# Altium schematic sheet top.SchDoc: Top
size A; Organization: Cal Poly Racing; engineer1: Graydon Wilson
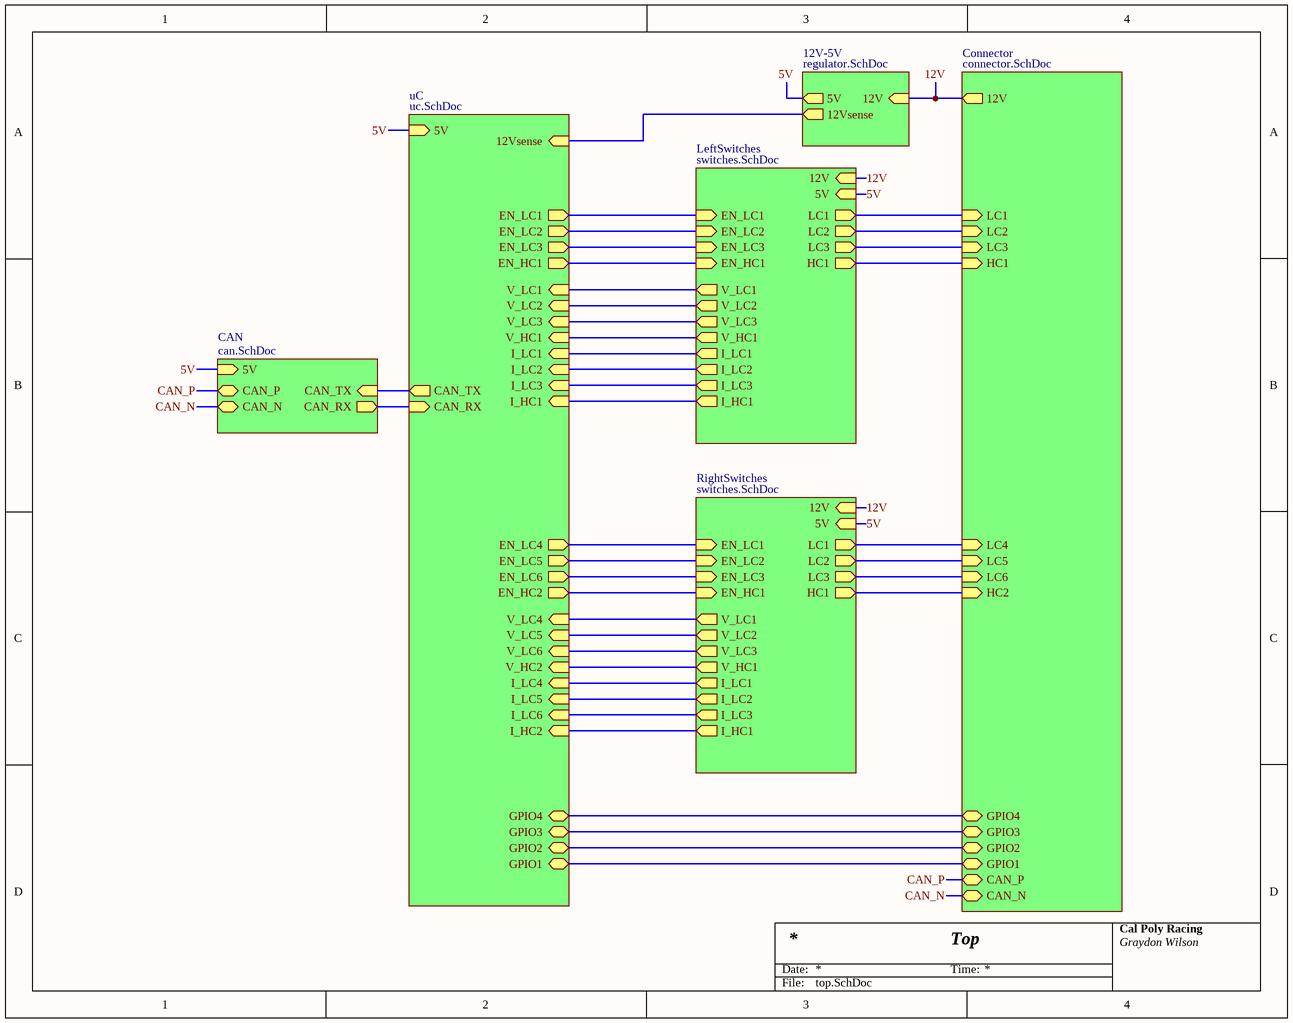
[diagram p0: top.SchDoc]

## Sub-sheets
12V-5V = regulator.SchDoc: 12V (in), 5V (out), 12Vsense (out)
CAN = can.SchDoc: 5V (in), CAN_P (bidir), CAN_N (bidir), CAN_TX (in), CAN_RX (out)
Connector = connector.SchDoc: 12V (out), LC1 (in), LC2 (in), LC3 (in), HC1 (in), CAN_P (bidir), CAN_N (bidir), LC4 (in), LC5 (in), LC6 (in), HC2 (in), GPIO4 (bidir), GPIO2 (bidir), GPIO1 (bidir), GPIO3 (bidir)
LeftSwitches = switches.SchDoc: LC1 (out), LC2 (out), LC3 (out), HC1 (out), I_LC1 (out), I_LC2 (out), I_LC3 (out), I_HC1 (out), V_HC1 (out), V_LC3 (out), V_LC2 (out), V_LC1 (out), EN_LC1 (in), EN_LC2 (in), EN_LC3 (in), EN_HC1 (in), 12V (in), 5V (in)
RightSwitches = switches.SchDoc: LC1 (out), LC2 (out), LC3 (out), HC1 (out), I_LC1 (out), I_LC2 (out), I_LC3 (out), I_HC1 (out), V_HC1 (out), V_LC3 (out), V_LC2 (out), V_LC1 (out), EN_LC1 (in), EN_LC2 (in), EN_LC3 (in), EN_HC1 (in), 12V (in), 5V (in)
uC = uc.SchDoc: CAN_TX (out), 5V (in), CAN_RX (in), EN_LC1 (out), EN_LC2 (out), EN_LC3 (out), EN_HC1 (out), V_LC1 (in), V_LC2 (in), V_LC3 (in), V_HC1 (in), I_LC1 (in), I_LC2 (in), I_LC3 (in), I_HC1 (in), EN_LC4 (out), EN_LC5 (out), EN_LC6 (out), EN_HC2 (out), V_LC4 (in), V_LC5 (in), V_LC6 (in), V_HC2 (in), I_LC4 (in), I_LC5 (in), I_LC6 (in), I_HC2 (in), GPIO1 (bidir), GPIO2 (bidir), GPIO3 (bidir), GPIO4 (bidir), 12Vsense (in)

## Nets
5V: sheet CAN/5V, sheet uC/5V, sheet LeftSwitches/5V, sheet 12V-5V/5V, sheet RightSwitches/5V
12V: sheet LeftSwitches/12V, sheet Connector/12V, sheet 12V-5V/12V, sheet RightSwitches/12V
CAN_N: sheet CAN/CAN_N, sheet Connector/CAN_N
CAN_P: sheet CAN/CAN_P, sheet Connector/CAN_P
(unnamed): sheet CAN/CAN_TX, sheet uC/CAN_TX
(unnamed): sheet CAN/CAN_RX, sheet uC/CAN_RX
(unnamed): sheet uC/EN_LC1, sheet LeftSwitches/EN_LC1
(unnamed): sheet uC/EN_LC2, sheet LeftSwitches/EN_LC2
(unnamed): sheet uC/EN_LC3, sheet LeftSwitches/EN_LC3
(unnamed): sheet uC/EN_HC1, sheet LeftSwitches/EN_HC1
(unnamed): sheet uC/V_LC1, sheet LeftSwitches/V_LC1
(unnamed): sheet uC/V_LC2, sheet LeftSwitches/V_LC2
(unnamed): sheet uC/V_LC3, sheet LeftSwitches/V_LC3
(unnamed): sheet uC/V_HC1, sheet LeftSwitches/V_HC1
(unnamed): sheet uC/I_LC1, sheet LeftSwitches/I_LC1
(unnamed): sheet uC/I_LC2, sheet LeftSwitches/I_LC2
(unnamed): sheet uC/I_LC3, sheet LeftSwitches/I_LC3
(unnamed): sheet uC/I_HC1, sheet LeftSwitches/I_HC1
(unnamed): sheet uC/EN_LC4, sheet RightSwitches/EN_LC1
(unnamed): sheet uC/EN_LC5, sheet RightSwitches/EN_LC2
(unnamed): sheet uC/EN_LC6, sheet RightSwitches/EN_LC3
(unnamed): sheet uC/EN_HC2, sheet RightSwitches/EN_HC1
(unnamed): sheet uC/V_LC4, sheet RightSwitches/V_LC1
(unnamed): sheet uC/V_LC5, sheet RightSwitches/V_LC2
(unnamed): sheet uC/V_LC6, sheet RightSwitches/V_LC3
(unnamed): sheet uC/V_HC2, sheet RightSwitches/V_HC1
(unnamed): sheet uC/I_LC4, sheet RightSwitches/I_LC1
(unnamed): sheet uC/I_LC5, sheet RightSwitches/I_LC2
(unnamed): sheet uC/I_LC6, sheet RightSwitches/I_LC3
(unnamed): sheet uC/I_HC2, sheet RightSwitches/I_HC1
(unnamed): sheet uC/GPIO1, sheet Connector/GPIO1
(unnamed): sheet uC/GPIO2, sheet Connector/GPIO2
(unnamed): sheet uC/GPIO3, sheet Connector/GPIO3
(unnamed): sheet uC/GPIO4, sheet Connector/GPIO4
(unnamed): sheet uC/12Vsense, sheet 12V-5V/12Vsense
(unnamed): sheet LeftSwitches/LC1, sheet Connector/LC1
(unnamed): sheet LeftSwitches/LC2, sheet Connector/LC2
(unnamed): sheet LeftSwitches/LC3, sheet Connector/LC3
(unnamed): sheet LeftSwitches/HC1, sheet Connector/HC1
(unnamed): sheet Connector/LC4, sheet RightSwitches/LC1
(unnamed): sheet Connector/LC5, sheet RightSwitches/LC2
(unnamed): sheet Connector/LC6, sheet RightSwitches/LC3
(unnamed): sheet Connector/HC2, sheet RightSwitches/HC1

## Notes on the sheet
- Date:
- Time:
- File: